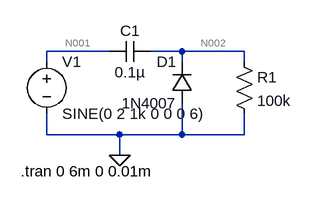
[diagram p0: schematic POSITIVE_CLAMPER.asc]
POSITIVE_CLAMPER.asc, the LTspice schematic file:
Version 4.1
SHEET 1 880 680
WIRE 160 112 64 112
WIRE 272 112 224 112
WIRE 368 112 272 112
WIRE 64 128 64 112
WIRE 272 128 272 112
WIRE 368 128 368 112
WIRE 64 240 64 208
WIRE 176 240 64 240
WIRE 272 240 272 192
WIRE 272 240 176 240
WIRE 368 240 368 208
WIRE 368 240 272 240
WIRE 176 272 176 240
FLAG 176 272 0
SYMBOL voltage 64 112 R0
WINDOW 123 0 0 Left 0
WINDOW 39 0 0 Left 0
SYMATTR InstName V1
SYMATTR Value SINE(0 2 1k 0 0 0 6)
SYMBOL cap 224 96 R90
WINDOW 0 0 32 VBottom 2
WINDOW 3 32 32 VTop 2
SYMATTR InstName C1
SYMATTR Value 0.1µ
SYMBOL diode 288 192 R180
WINDOW 0 24 64 Left 2
WINDOW 3 24 0 Left 2
SYMATTR InstName D1
SYMATTR Value 1N4007
SYMBOL res 352 112 R0
SYMATTR InstName R1
SYMATTR Value 100k
TEXT 24 296 Left 2 !.tran 0 6m 0 0.01m

The netlist it stands for:
* POSITIVE_CLAMPER.asc
V1 N001 0 SINE(0 2 1k 0 0 0 6)
C1 N002 N001 0.1µ
D1 0 N002 1N4007
R1 N002 0 100k
.model D D
.lib standard.dio
.tran 0 6m 0 0.01m
.backanno
.end

* Results of the author's LTspice run, read from the files saved beside the schematic
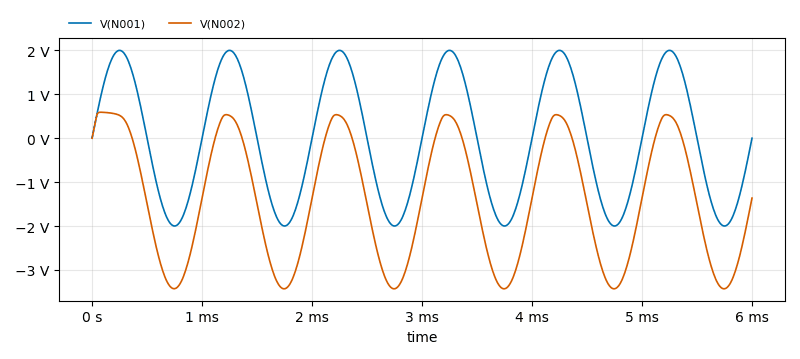
[diagram p1: Transient Analysis of POSITIVE_CLAMPER.asc, plotted from the saved traces]
* Transient Analysis, 1 run:
*   V(N001): min -2 V, max 2 V, average 17.91 µV, rms 1.414 V, last 0 V
*   V(N002): min -3.43 V, max 591.2 mV, average -1.409 V, rms 2.01 V, last -1.363 V